# EAGLE design VOX V847 (EAGLE 7.5.0)
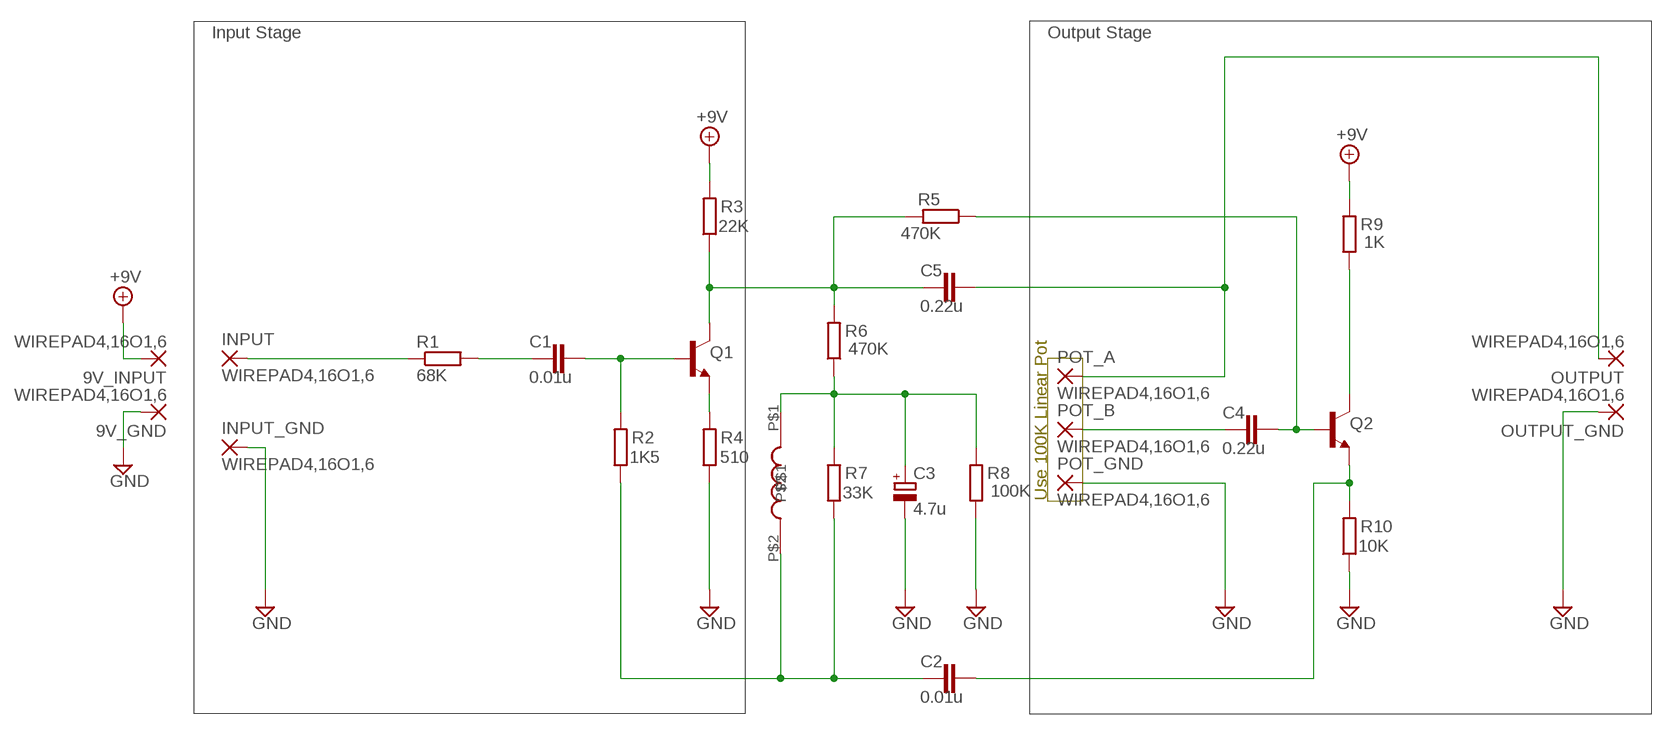
[diagram p0: schematic, sheet 1]

## Parts
9V_GND  WIREPAD4,16O1,6  [4,16O1,6]
9V_INPUT  WIREPAD4,16O1,6  [4,16O1,6]
C1  0.01u  C-EU050-024X044  [C050-024X044]
C2  0.01u  C-EU050-024X044  [C050-024X044]
C3  4.7u  CPOL-EUE5-5  [E5-5]
C4  0.22u  C-EU075-042X103  [C075-042X103]
C5  0.22u  C-EU050-024X044  [C050-024X044]
INPUT  WIREPAD4,16O1,6  [4,16O1,6]
INPUT_GND  WIREPAD4,16O1,6  [4,16O1,6]
OUTPUT  WIREPAD4,16O1,6  [4,16O1,6]
OUTPUT_GND  WIREPAD4,16O1,6  [4,16O1,6]
POT_A  WIREPAD4,16O1,6  [4,16O1,6]
POT_B  WIREPAD4,16O1,6  [4,16O1,6]
POT_GND  WIREPAD4,16O1,6  [4,16O1,6]
Q1  MPSA18-NPN-TO92-EBC  [TO92-EBC]
Q2  MPSA18-NPN-TO92-EBC  [TO92-EBC]
R1  68K  R-EU_0207/7  [0207/7]
R2  1K5  R-EU_0207/12  [0207/12]
R3  22K  R-EU_0207/7  [0207/7]
R4  510  R-EU_0207/10  [0207/10]
R5  470K  R-EU_0207/7  [0207/7]
R6  470K  R-EU_0207/7  [0207/7]
R7  33K  R-EU_0207/7  [0207/7]
R8  100K  R-EU_0207/7  [0207/7]
R9  1K  R-EU_0207/12  [0207/12]
R10  10K  R-EU_0207/7  [0207/7]
U$1  FL01Y  [FL01Y]

## Nets
+9V: 9V_INPUT.1(P) R3.2 R9.2
GND: 9V_GND.1(P) C3.- INPUT_GND.1(P) OUTPUT_GND.1(P) POT_GND.1(P) R4.1 R8.1 R10.1
N$1: INPUT.1(P) R1.1
N$2: C1.2 Q1.B R2.2
N$3: C1.1 R1.2
N$4: C2.2 Q2.E R10.2
N$5: Q1.E R4.2
N$6: C5.1 Q1.C R3.1 R5.2 R6.2
N$7: C3.+ R6.1 R7.2 R8.2 U$1.P$1
N$8: C2.1 R2.1 R7.1 U$1.P$2
N$9: C4.2 Q2.B R5.1
N$10: C4.1 POT_B.1(P)
N$11: C5.2 OUTPUT.1(P) POT_A.1(P)
N$12: Q2.C R9.1

## Notes on the sheet
- Input Stage | Output Stage
- Use 100K Linear Pot

## Library data of the parts
9V_GND 9V_INPUT INPUT INPUT_GND OUTPUT OUTPUT_GND POT_A POT_B POT_GND = wirepad:WIREPAD: Wire PAD connect wire on PCB
C1 C2 C4 C5 = rcl:C-EU: CAPACITOR, European symbol
C3 = resistor:CPOL-EU: POLARIZED CAPACITOR, European symbol
Q1 Q2 = transistor:*-NPN-: NPN Transistror BF959 corrected 2008.03.06
R1-R10 = rcl:R-EU_: RESISTOR, European symbol
U$1 = FASEL:FL01Y

## Board
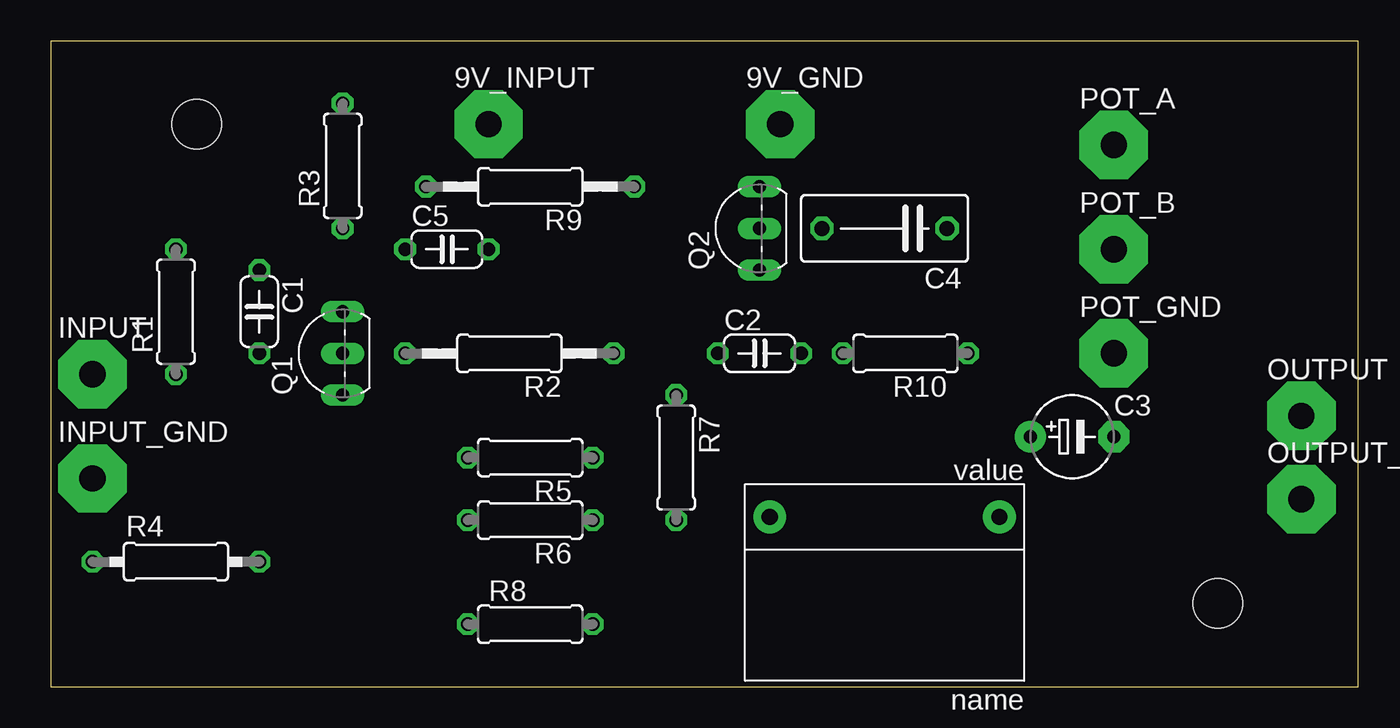
[diagram p1: board, top side]
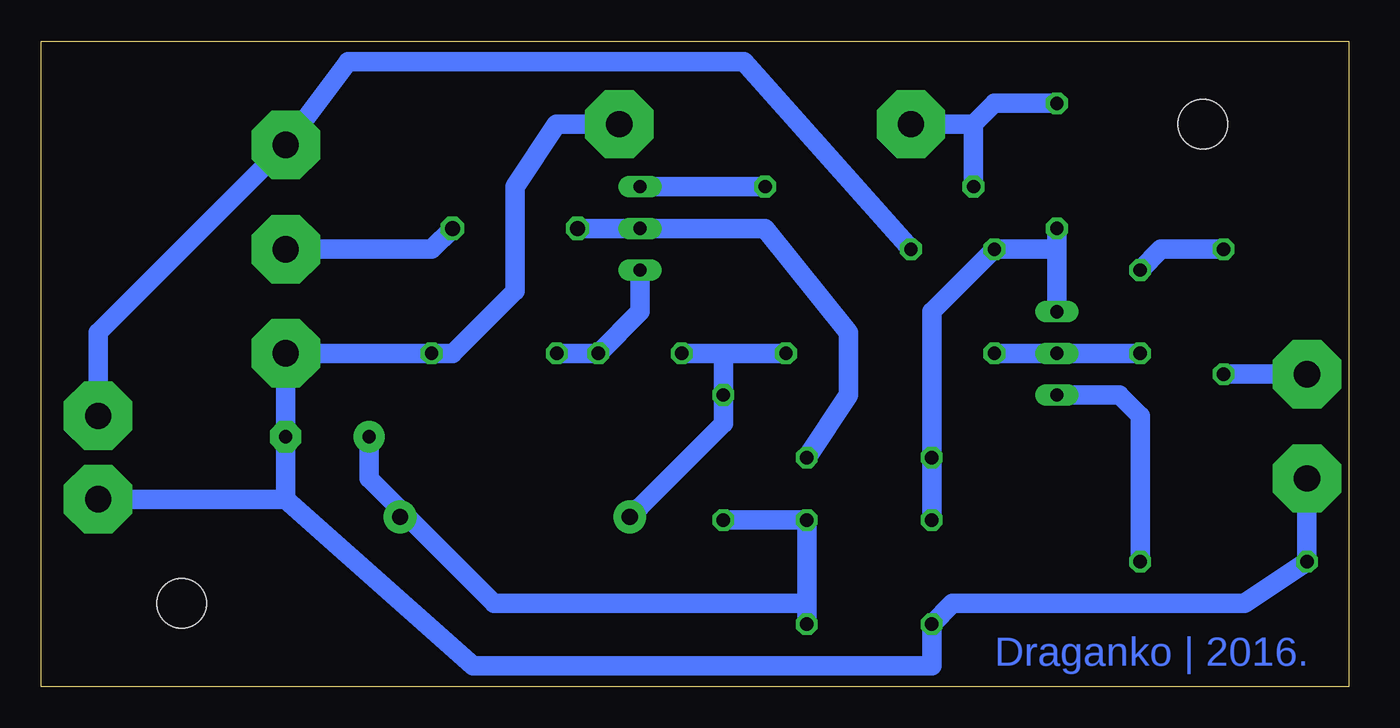
[diagram p2: board, bottom side, seen from below]

Size 79.68 x 39.36 mm. Coordinates in mm from the lower left corner, seen from the top.
Outline: 0,0 79.68,0 79.68,39.36 0,39.36 0,0
Copper layers (1*16): Top 0.035mm / dielectric 1.5mm / Bottom 0.035mm
Design rules "default *": minimum track width 1mm, minimum drill 24mil, track to track 1mm, track to pad 1mm, pad to pad 1mm, via to via 1mm, smd to smd 8mil, copper to edge 1mm, drill to drill 1mm, minimum pad ring 10mil, minimum via ring 8mil, stop-mask expansion 4mil, vias tented up to drill 0mil, thermal gap 10mil
Holes 3 mm at 71.12,5.08 8.89,34.29

### Footprints (pad centres in the part's own frame; a part is rotated, then mirrored left to right if it is on the bottom)
4,16O1,6 = drill 1.6 pad 4.166 octagon: 1 0,0
C050-024X044 = drill 0.813 octagon: 1 -2.54,0; 2 2.54,0
E5-5 = drill 0.813 pad 1.905: + -2.54,0 | drill 0.813 pad 1.905 octagon: - 2.54,0
C075-042X103 = drill 0.914 octagon: 1 -3.81,0; 2 3.81,0
TO92-EBC = drill 0.813 long: B 0,-1.27; C 2.54,-1.27; E -2.54,-1.27
0207/7 = drill 0.813 octagon: 1 -3.81,0; 2 3.81,0
0207/12 = drill 0.813 octagon: 1 -6.35,0; 2 6.35,0
0207/10 = drill 0.813 octagon: 1 -5.08,0; 2 5.08,0
FL01Y = drill 1 pad 2: P$1 -7,-4; P$2 7,-4

### Placement (x,y rotation side)
9V_GND  44.45,34.29 0 top
9V_INPUT  26.67,34.29 0 top
C1  12.7,22.86 270 top
C2  43.18,20.32 0 top
C3  62.23,15.24 0 top
C4  50.8,27.94 180 top
C5  24.13,26.67 0 top
INPUT  2.54,19.05 0 top
INPUT_GND  2.54,12.7 0 top
OUTPUT  76.2,16.51 0 top
OUTPUT_GND  76.2,11.43 0 top
POT_A  64.77,33.02 0 top
POT_B  64.77,26.67 0 top
POT_GND  64.77,20.32 0 top
Q1  16.51,20.32 90 top
Q2  41.91,27.94 90 top
R1  7.62,22.86 90 top
R2  27.94,20.32 180 top
R3  17.78,31.75 90 top
R4  7.62,7.62 0 top
R5  29.21,13.97 180 top
R6  29.21,10.16 180 top
R7  38.1,13.97 270 top
R8  29.21,3.81 0 top
R9  29.21,30.48 180 top
R10  52.07,20.32 180 top
U$1  50.8,6.35 180 top

### Tracks (layer width: path | path; a pad name or v marks a point on that pad's centre or on a via)
+9V
  Bottom 1.2: 9V_INPUT.1 22.86,34.29 | 22.86,34.29 R9.2 | R3.2 21.59,35.56 22.86,34.29
GND
  Bottom 1.2: INPUT_GND.1 R4.1 6.35,5.08 24.13,5.08 R8.1 25.4,1.27 53.34,1.27 64.77,11.43 | 64.77,11.43 C3.- POT_GND.1 R10.1 54.61,20.32 50.8,24.13 50.8,30.48 48.26,34.29 9V_GND.1 | OUTPUT_GND.1 64.77,11.43
N$1
  Bottom 1.2: INPUT.1 R1.1
N$2
  Bottom 1.2: C1.2 Q1.B R2.2
N$3
  Bottom 1.2: R1.2 11.43,26.67 C1.1
N$4
  Bottom 1.2: Q2.E 43.18,22.86 C2.2 R10.2
N$5
  Bottom 1.2: Q1.E 13.97,17.78 12.7,16.51 R4.2
N$6
  Bottom 1.2: Q1.C 17.78,26.67 | 17.78,26.67 R3.1 | 17.78,26.67 C5.1 25.4,22.86 R5.2 R6.2
N$7
  Bottom 1.2: 33.02,5.08 R6.1 R7.2 | 33.02,5.08 R8.2 | C3.+ 59.69,12.7 57.8,10.81 U$1.P$1 57.34,10.35 52.07,5.08 33.02,5.08
N$8
  Bottom 1.2: R2.1 38.1,20.32 | 38.1,20.32 C2.1 | 38.1,20.32 R7.1 38.1,16.05 U$1.P$2 43.18,10.97
N$9
  Bottom 1.2: R5.1 30.48,17.78 30.48,21.59 35.56,27.94 Q2.B C4.2
N$10
  Bottom 1.2: POT_B.1 55.88,26.67 C4.1
N$11
  Bottom 1.2: OUTPUT.1 76.2,21.59 POT_A.1 60.96,38.1 36.83,38.1 C5.2
N$12
  Bottom 1.2: R9.1 Q2.C

### Text on the board
Bottom: Draganko | 2016.